# EAGLE design block_statut_led (EAGLE 7.7.0)
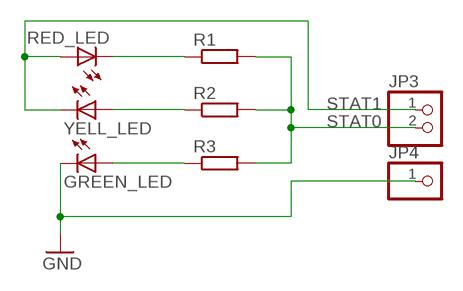
[diagram p0: schematic, sheet 1]

## Parts
GREEN_LED  LED3MM  [LED3MM]
JP3  PINHD-1X2  [1X02]
JP4  PINHD-1X1  [1X01]
R1  R-EU_0207/5V  [0207/5V]
R2  R-EU_0207/5V  [0207/5V]
R3  R-EU_0207/5V  [0207/5V]
RED_LED  LED3MM  [LED3MM]
YELL_LED  LED3MM  [LED3MM]

## Nets
GND: GREEN_LED.K(C) JP4.1
N$3: R1.1 RED_LED.K(C)
N$4: R2.1 YELL_LED.A
N$5: GREEN_LED.A R3.1
STAT0: JP3.2 R1.2 R2.2 R3.2
STAT1: JP3.1 RED_LED.A YELL_LED.K(C)

## Library data of the parts
GREEN_LED RED_LED YELL_LED = led:LED: LED OSRAM: - CHIPLED LG R971, LG N971, LY N971, LG Q971, LY Q971, LO R971, LY R971 LH N974, LH R974 LS Q976, LO Q976, LY Q976 LO Q996 - Hyper CHIPLED LW Q18S LB Q993, LB Q99A, LB R99A - SideLED LS A670, LO A670, LY A670, LG A670, LP A670 LB A673, LV A673, LT A673, LW A673 LH A674 LY A675 LS A676, LA A676, LO A676, LY A676, LW A676 LS A679, LY A679, LG A679 - Hyper Micro SIDELED® LS Y876, LA Y876, LO Y876, LY Y876 LT Y87S - SmartLED LW L88C, LW L88S LB L89C, LB L89S, LG L890 LS L89K, LO L89K, LY L89K LS L896, LA L896, LO L896, LY L896 - TOPLED LS T670, LO T670, LY T670, LG T670, LP T670 LSG T670, LSP T670, LSY T670, LOP T670, LYG T670 LG T671, LOG T671, LSG T671 LB T673, LV T673, LT T673, LW T673 LH T674 LS T676, LA T676, LO T676, LY T676, LB T676, LH T676, LSB T676, LW T676 LB T67C, LV T67C, LT T67C, LS T67K, LO T67K, LY T67K, LW E67C LS E67B, LA E67B, LO E67B, LY E67B, LB E67C, LV E67C, LT E67C LW T67C LS T679, LY T679, LG T679 LS T770, LO T770, LY T770, LG T770, LP T770 LB T773, LV T773, LT T773, LW T773 LH T774 LS E675, LA E675, LY E675, LS T675 LS T776, LA T776, LO T776, LY T776, LB T776 LHGB T686 LT T68C, LB T68C - Hyper Mini TOPLED® LB M676 - Mini TOPLED Santana® LG M470 LS M47K, LO M47K, LY M47K Source: http://www.osram.convergy.de LUXEON: - LUMILED® LXK2-PW12-R00, LXK2-PW12-S00, LXK2-PW14-U00, LXK2-PW14-V00 LXK2-PM12-R00, LXK2-PM12-S00, LXK2-PM14-U00 LXK2-PE12-Q00, LXK2-PE12-R00, LXK2-PE12-S00, LXK2-PE14-T00, LXK2-PE14-U00 LXK2-PB12-K00, LXK2-PB12-L00, LXK2-PB12-M00, LXK2-PB14-N00, LXK2-PB14-P00, LXK2-PB14-Q00 LXK2-PR12-L00, LXK2-PR12-M00, LXK2-PR14-Q00, LXK2-PR14-R00 LXK2-PD12-Q00, LXK2-PD12-R00, LXK2-PD12-S00 LXK2-PH12-R00, LXK2-PH12-S00 LXK2-PL12-P00, LXK2-PL12-Q00, LXK2-PL12-R00 Source: www.luxeon.com KINGBRIGHT: KA-3528ASYC Source: www.kingbright.com
JP3 = pinhead:PINHD-1X2: PIN HEADER
JP4 = pinhead:PINHD-1X1: PIN HEADER
R1-R3 = resistor:R-EU_: RESISTOR, European symbol

## Board
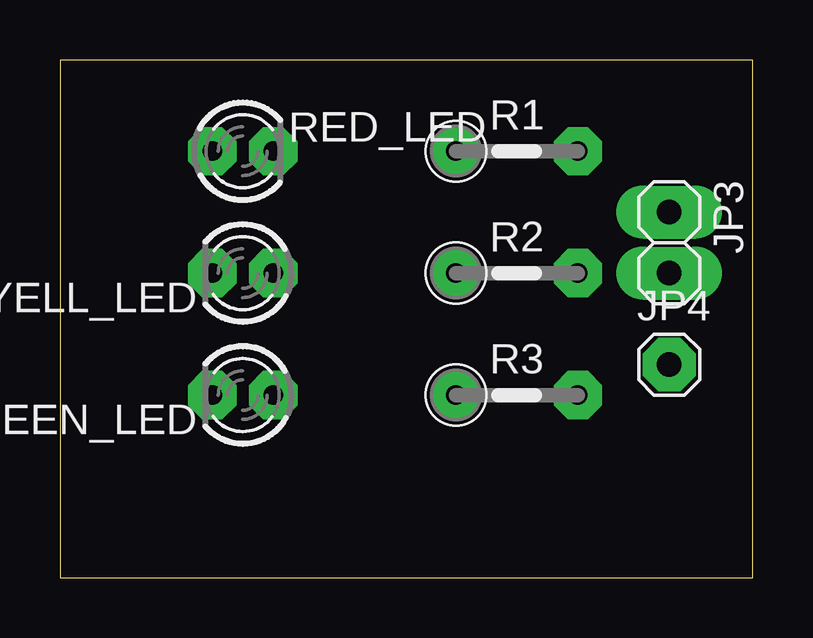
[diagram p1: board, top side]
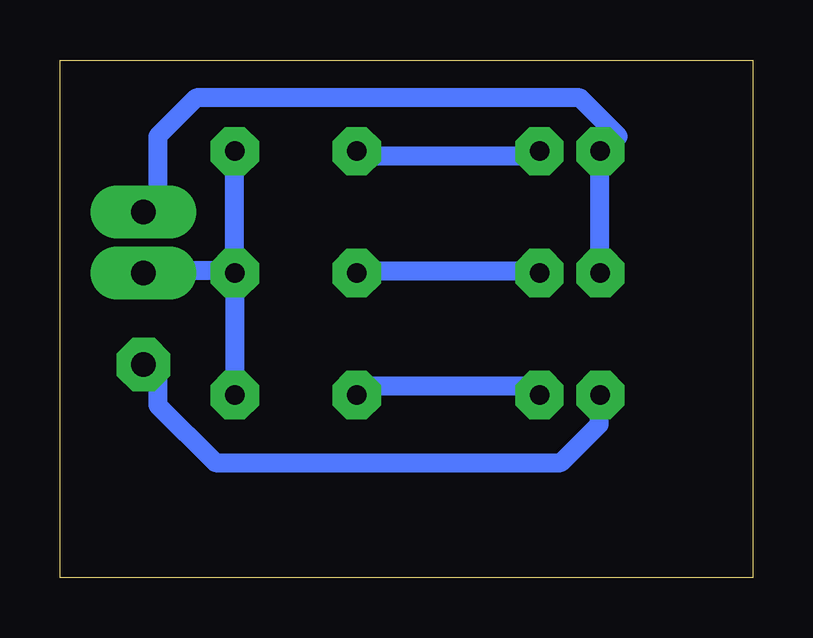
[diagram p2: board, bottom side, seen from below]

Size 28.88 x 21.58 mm. Coordinates in mm from the lower left corner, seen from the top.
Outline: 0,0 28.88,0 28.88,21.58 0,21.58 0,0
Copper layers (1*16): Top 0.035mm / dielectric 1.5mm / Bottom 0.035mm
Design rules "hobby": minimum track width 0.8mm, minimum drill 0.8mm, track to track 0.8mm, track to pad 0.8mm, pad to pad 0.45mm, via to via 0.8mm, smd to smd 8mil, copper to edge 10mil, drill to drill 8mil, minimum pad ring 0.6mm, minimum via ring 0.6mm, stop-mask expansion 0mil, vias tented up to drill 0mil, thermal gap 10mil

### Footprints (pad centres in the part's own frame; a part is rotated, then mirrored left to right if it is on the bottom)
LED3MM = drill 0.813 octagon: A -1.27,0; K 1.27,0
1X02 = drill 1.016 long: 1 -1.27,0; 2 1.27,0
1X01 = drill 1.016 octagon: 1 0,0
0207/5V = drill 0.813 octagon: 1 -2.54,0; 2 2.54,0

### Placement (x,y rotation side)
GREEN_LED  7.62,7.62 180 top
JP3  25.4,13.97 270 top
JP4  25.4,8.89 0 top
R1  19.05,17.78 0 top
R2  19.05,12.7 0 top
R3  19.05,7.62 0 top
RED_LED  7.62,17.78 0 top
YELL_LED  7.62,12.7 180 top

### Tracks (layer width: path | path; a pad name or v marks a point on that pad's centre or on a via)
GND
  Bottom 0.8: GREEN_LED.K 6.4,7.2 6.4,6.4 8,4.8 22.4,4.8 24.8,7.2 24.8,8.8 JP4.1
N$3
  Bottom 0.8: RED_LED.K 9.6,17.6 16,17.6 R1.1
N$4
  Bottom 0.254: 16.46,12.8 R2.1
  Bottom 0.8: YELL_LED.A 9.6,12.8 16,12.8 R2.1
N$5
  Bottom 0.8: GREEN_LED.A 9.6,8 16,8 R3.1
STAT0
  Bottom 0.8: R3.2 21.6,8 21.6,12 R2.2 21.6,12.8 | 21.6,12.8 21.6,17.6 R1.2 | 21.6,12.8 24.8,12.8 JP3.2
STAT1
  Bottom 0.8: YELL_LED.K 6.4,12.8 6.4,17.6 RED_LED.A 5.6,18.4 7.2,20 23.2,20 24.8,18.4 24.8,16 JP3.1